# EAGLE design Eagle_Dued_autorouted (EAGLE 6.4)
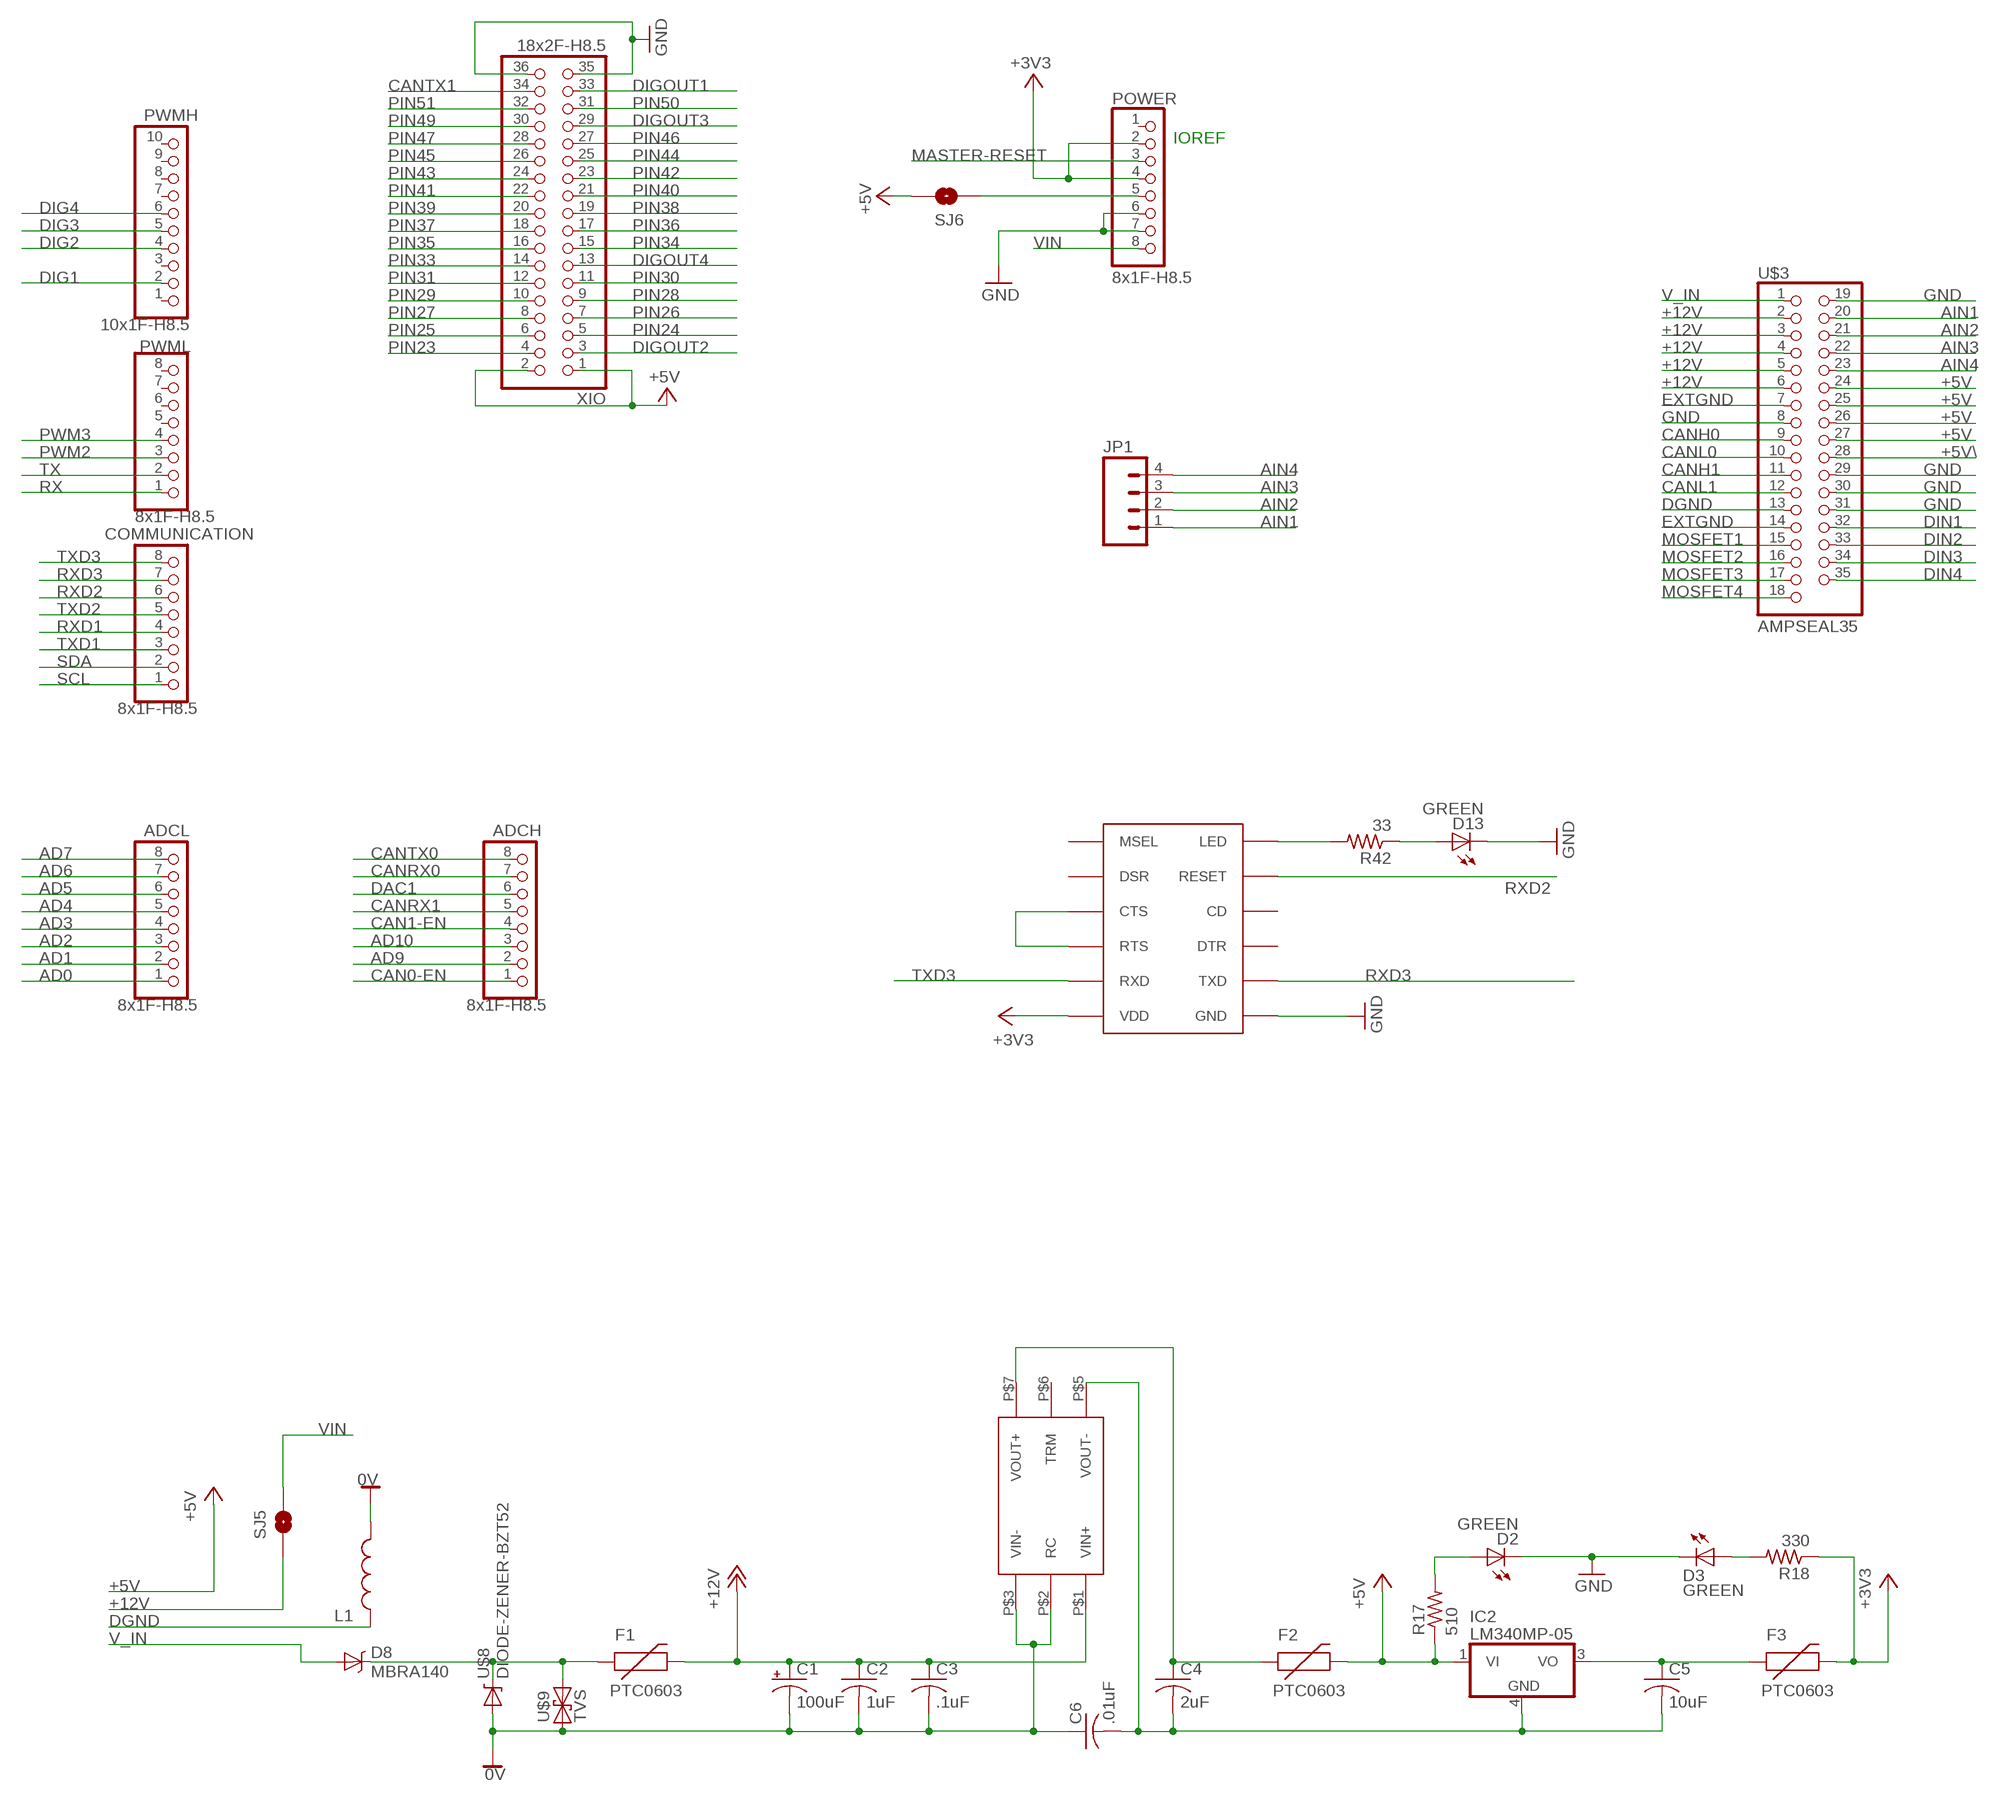
[diagram p0: schematic, sheet 1, part 1 of 2]
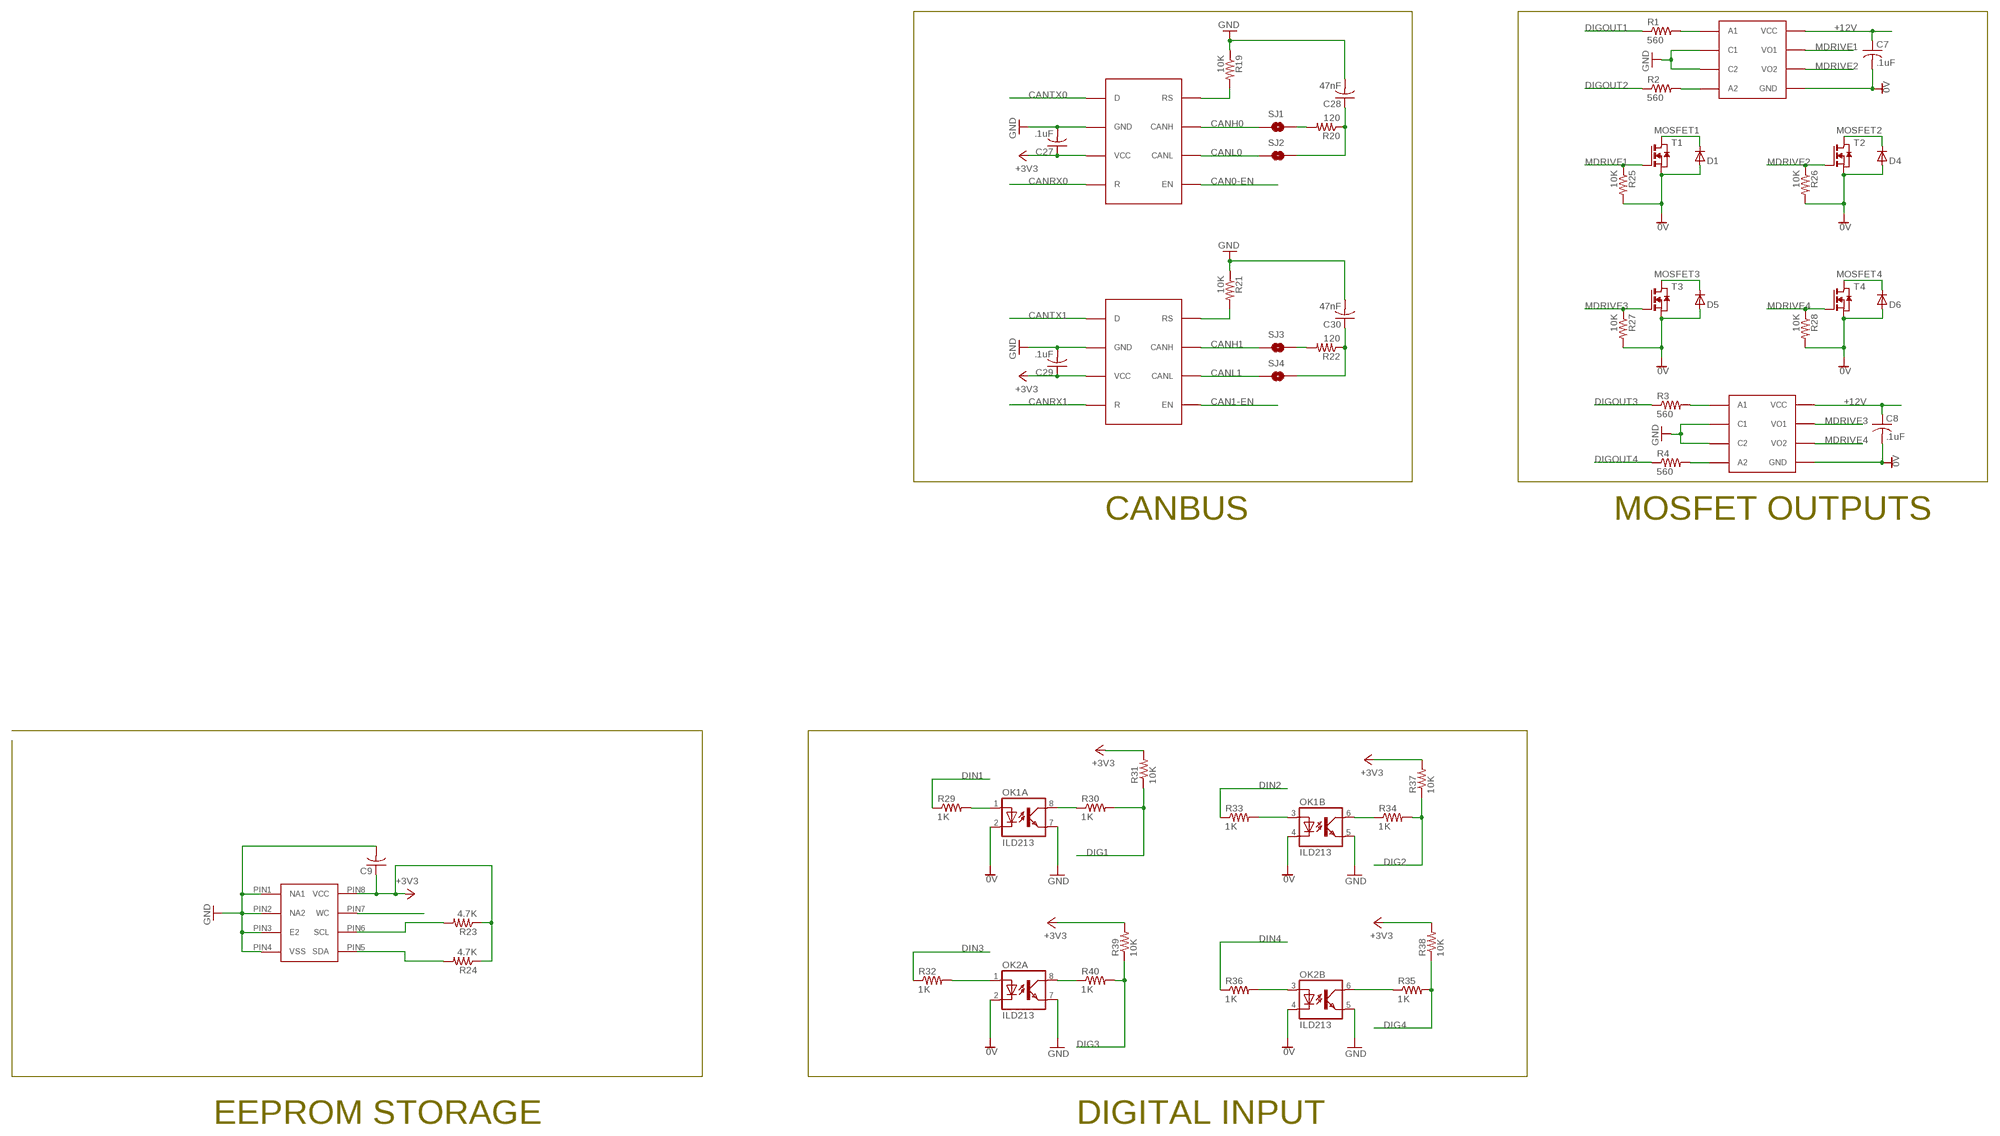
[diagram p1: schematic, sheet 1, part 2 of 2]

## Parts
ADCH  8x1F-H8.5  PINHD-1X8  [1X08]
ADCL  8x1F-H8.5  PINHD-1X8  [1X08]
C1  100uF  CPOL-USE2.5-6  [E2,5-6]
C2  1uF  C-USC1206  [C1206]
C3  .1uF  C-USC1206  [C1206]
C4  2uF  C-USC0805  [C0805]
C5  10uF  C-USC1206  [C1206]
C6  .01uF  C-USC1206  [C1206]
C7  .1uF  C-USC1206  [C1206]
C8  .1uF  C-USC1206  [C1206]
C9  C-USC0603  [C0603]
C27  .1uF  C-USC0603  [C0603]
C28  47nF  C-USC0603  [C0603]
C29  .1uF  C-USC0603  [C0603]
C30  47nF  C-USC0603  [C0603]
COMMUNICATION  8x1F-H8.5  PINHD-1X8  [1X08]
D1  MBR0520LT  [SOD123]
D2  GREEN  LED-GREEN0603  [LED-0603]
D3  GREEN  LED-GREEN0603  [LED-0603]
D4  MBR0520LT  [SOD123]
D5  MBR0520LT  [SOD123]
D6  MBR0520LT  [SOD123]
D8  MBRA140  [SMA-DIODE]
D13  GREEN  LED-GREEN0603  [LED-0603]
F1  PTC0603  [0603]
F2  PTC0603  [0603]
F3  PTC0603  [0603]
IC2  LM340MP-05  [SOT223]
JP1  M04POLAR  [MOLEX-1X4]
L1  INDUCTOR1206H*  [INDUCTOR-1206]
OK1  ILD213  [SOIC08]
OK2  ILD213  [SOIC08]
POWER  8x1F-H8.5  PINHD-1X8  [1X08]
PWMH  10x1F-H8.5  PINHD-1X10  [1X10]
PWML  8x1F-H8.5  PINHD-1X8  [1X08]
R1  560  R-US_R0603  [R0603]
R2  560  R-US_R0603  [R0603]
R3  560  R-US_R0603  [R0603]
R4  560  R-US_R0603  [R0603]
R17  510  R-US_R0603  [R0603]
R18  330  R-US_R0603  [R0603]
R19  10K  R-US_R0603  [R0603]
R20  120  R-US_R0603  [R0603]
R21  10K  R-US_R0603  [R0603]
R22  120  R-US_R0603  [R0603]
R23  4.7K  R-US_R0603  [R0603]
R24  4.7K  R-US_R0603  [R0603]
R25  10K  R-US_R0603  [R0603]
R26  10K  R-US_R0603  [R0603]
R27  10K  R-US_R0603  [R0603]
R28  10K  R-US_R0603  [R0603]
R29  1K  R-US_R0603  [R0603]
R30  1K  R-US_R0603  [R0603]
R31  10K  R-US_R0603  [R0603]
R32  1K  R-US_R0603  [R0603]
R33  1K  R-US_R0603  [R0603]
R34  1K  R-US_R0603  [R0603]
R35  1K  R-US_R0603  [R0603]
R36  1K  R-US_R0603  [R0603]
R37  10K  R-US_R0603  [R0603]
R38  10K  R-US_R0603  [R0603]
R39  10K  R-US_R0603  [R0603]
R40  1K  R-US_R0603  [R0603]
R42  33  R-US_R0603  [R0603]
SJ1  SOLDERJUMPERNO  [SJ_2S-NO]
SJ2  SOLDERJUMPERNO  [SJ_2S-NO]
SJ3  SOLDERJUMPERNO  [SJ_2S-NO]
SJ4  SOLDERJUMPERNO  [SJ_2S-NO]
SJ5  SOLDERJUMPERNO  [SJ_2S-NO]
SJ6  SOLDERJUMPERNO  [SJ_2S-NO]
T1  NMOSSOT223  [SOT223]
T2  NMOSSOT223  [SOT223]
T3  NMOSSOT223  [SOT223]
T4  NMOSSOT223  [SOT223]
U$1  CC3-E  [CC3-E]
U$2  SN65HVD234  [SOIC8]
U$3  AMPSEAL35  [AMPSEAL35]
U$4  MINIWIFI  [MINIWIFI]
U$5  M24M02-DRMN6TP  [SOIC8]
U$6  SN65HVD234  [SOIC8]
U$7  SFH6731  [DIP8]
U$8  DIODE-ZENER-BZT52  [SOD-323]
U$9  TVS  [SMA-DIODE]
U$10  SFH6731  [DIP8]
XIO  18x2F-H8.5  PINHD-2X18  [2X18]

## Nets
0V: C7.2 C8.2 OK1.2(A:C) OK1.4(B:C) OK2.2(A:C) OK2.4(B:C) U$7.5(GND) U$10.5(GND)
+3V3: C9.1 C27.1 C29.1 F3.2 POWER.2 POWER.4 R18.1 R23.1 R24.1 R31.2 R37.2 R38.2 R39.2 U$2.PIN3(VCC) U$4.P$1(VDD) U$5.PIN8(VCC) U$6.PIN3(VCC)
+5V: F2.2 IC2.1(VI) R17.1 SJ6.2 U$3.24 U$3.25 U$3.26 U$3.27 XIO.1 XIO.2
+5V\: U$3.28
+12V: C1.+ C2.1 C3.1 C7.1 C8.1 F1.2 SJ5.1 U$1.P$1(VIN+) U$3.2 U$3.3 U$3.4 U$3.5 U$3.6 U$7.8(VCC) U$10.8(VCC)
AD0: ADCL.1
AD1: ADCL.2
AD2: ADCL.3
AD3: ADCL.4
AD4: ADCL.5
AD5: ADCL.6
AD6: ADCL.7
AD7: ADCL.8
AD9: ADCH.2
AD10: ADCH.3
AIN1: JP1.1 U$3.20
AIN2: JP1.2 U$3.21
AIN3: JP1.3 U$3.22
AIN4: JP1.4 U$3.23
CAN0-EN: ADCH.1 U$6.PIN5(EN)
CAN1-EN: ADCH.4 U$2.PIN5(EN)
CANH0: SJ1.1 U$3.9 U$6.PIN7(CANH)
CANH1: SJ3.1 U$2.PIN7(CANH) U$3.11
CANL0: SJ2.1 U$3.10 U$6.PIN6(CANL)
CANL1: SJ4.1 U$2.PIN6(CANL) U$3.12
CANRX0: ADCH.7 U$6.PIN4(R)
CANRX1: ADCH.5 U$2.PIN4(R)
CANTX0: ADCH.8 U$6.PIN1(D)
CANTX1: U$2.PIN1(D) XIO.34
DAC1: ADCH.6
DGND: L1.P$1 U$3.13
DIG1: PWMH.2 R30.2 R31.1
DIG2: PWMH.4 R34.2 R37.1
DIG3: PWMH.5 R39.1 R40.2
DIG4: PWMH.6 R35.2 R38.1
DIGOUT1: R1.1 XIO.33
DIGOUT2: R2.1 XIO.3
DIGOUT3: R3.1 XIO.29
DIGOUT4: R4.1 XIO.13
DIN1: R29.1 U$3.32
DIN2: R33.1 U$3.33
DIN3: R32.1 U$3.34
DIN4: R36.1 U$3.35
EXTGND: C1.- C2.2 C3.2 C6.1 D1.A D4.A D5.A D6.A L1.P$2 R25.2 R26.2 R27.2 R28.2 T1.3(S) T2.3(S) T3.3(S) T4.3(S) U$1.P$2(RC) U$1.P$3(VIN-) U$3.7 U$3.14 U$8.2(A) U$9.A ; supply symbol labelled 0V
GND: C4.2 C5.2 C6.2 C9.2 C27.2 C28.2 C29.2 C30.2 D2.C D3.C D13.C IC2.4(GND) OK1.5(B:EMIT) OK1.7(A:EMIT) OK2.5(B:EMIT) OK2.7(A:EMIT) POWER.6 POWER.7 R19.1 R21.1 U$1.P$5(VOUT-) U$2.PIN2(GND) U$3.8 U$3.19 U$3.29 U$3.30 U$3.31 U$4.P$2(GND) U$5.PIN1(NA1) U$5.PIN2(NA2) U$5.PIN3(E2) U$5.PIN4(VSS) U$6.PIN2(GND) U$7.2(C1) U$7.3(C2) U$10.2(C1) U$10.3(C2) XIO.35 XIO.36
MASTER-RESET: POWER.3
MDRIVE1: R25.1 T1.1(G) U$10.7(VO1)
MDRIVE2: R26.1 T2.1(G) U$10.6(VO2)
MDRIVE3: R27.1 T3.1(G) U$7.7(VO1)
MDRIVE4: R28.1 T4.1(G) U$7.6(VO2)
MOSFET1: D1.C T1.2(D) T1.4(D) U$3.15
MOSFET2: D4.C T2.2(D) T2.4(D) U$3.16
MOSFET3: D5.C T3.2(D) T3.4(D) U$3.17
MOSFET4: D6.C T4.2(D) T4.4(D) U$3.18
N$1: POWER.5 SJ6.1
N$2: U$4.P$5(RTS) U$4.P$7(CTS)
N$3: D8.C F1.1 U$8.1(C) U$9.C
N$4: R42.2 U$4.P$12(LED)
N$5: R3.2 U$7.1(A1)
N$6: C4.1 F2.1 U$1.P$7(VOUT+)
N$7: R1.2 U$10.1(A1)
N$8: C5.1 F3.1 IC2.3(VO)
N$9: D13.A R42.1
N$10: R2.2 U$10.4(A2)
N$11: R4.2 U$7.4(A2)
N$23: D2.A R17.2
N$24: R19.2 U$6.PIN8(RS)
N$25: D3.A R18.2
N$26: C28.1 R20.1 SJ2.2
N$27: R20.2 SJ1.2
N$28: R21.2 U$2.PIN8(RS)
N$29: C30.1 R22.1 SJ4.2
N$30: R22.2 SJ3.2
N$31: OK1.1(A:A) R29.2
N$32: OK1.3(B:A) R33.2
N$33: OK1.8(A:COL) R30.1
N$34: OK1.6(B:COL) R34.1
N$36: OK2.6(B:COL) R35.1
N$38: OK2.8(A:COL) R40.1
N$40: OK2.1(A:A) R32.2
N$43: OK2.3(B:A) R36.2
PIN23: XIO.4
PIN24: XIO.5
PIN25: XIO.6
PIN26: XIO.7
PIN27: XIO.8
PIN28: XIO.9
PIN29: XIO.10
PIN30: XIO.11
PIN31: XIO.12
PIN33: XIO.14
PIN34: XIO.15
PIN35: XIO.16
PIN36: XIO.17
PIN37: XIO.18
PIN38: XIO.19
PIN39: XIO.20
PIN40: XIO.21
PIN41: XIO.22
PIN42: XIO.23
PIN43: XIO.24
PIN44: XIO.25
PIN45: XIO.26
PIN46: XIO.27
PIN47: XIO.28
PIN49: XIO.30
PIN50: XIO.31
PIN51: XIO.32
PWM2: PWML.3
PWM3: PWML.4
RX: PWML.1
RXD1: COMMUNICATION.4 U$5.PIN7(WC)
RXD2: COMMUNICATION.6 U$4.P$10(RESET)
RXD3: COMMUNICATION.7 U$4.P$4(TXD)
SCL: COMMUNICATION.1 R23.2 U$5.PIN6(SCL)
SDA: COMMUNICATION.2 R24.2 U$5.PIN5(SDA)
TX: PWML.2
TXD1: COMMUNICATION.3
TXD2: COMMUNICATION.5
TXD3: COMMUNICATION.8 U$4.P$3(RXD)
V_IN: D8.A U$3.1
VIN: POWER.8 SJ5.2
Unconnected: POWER.1 PWMH.1 PWMH.3 PWMH.7 PWMH.8 PWMH.9 PWMH.10 PWML.5 PWML.6 PWML.7 PWML.8 U$1.P$6(TRM) U$4.P$6(DTR) U$4.P$8(CD) U$4.P$9(DSR) U$4.P$11(MSEL)

## Notes on the sheet
- IOREF
- CANBUS | MOSFET OUTPUTS
- EEPROM STORAGE | DIGITAL INPUT

## Library data of the parts
ADCH ADCL COMMUNICATION POWER PWML = SmartPrj:PINHD-1X8: PIN HEADER
C1 = rcl:CPOL-US: POLARIZED CAPACITOR, American symbol
C2-C9 C27-C30 = rcl:C-US: CAPACITOR, American symbol
D1 D4-D6 = diode:MBR0520LT: SCHOTTKY BARRIER RECTIFIER Source: http://onsemi.com .. MBR0520LT1-D.pdf
D2 D3 D13 = SparkFun-LED:LED-GREEN: Various green LEDs 0603- DIO-00821 LARGE- DIO-00862 LILYPAD- DIO-09910; PROD_ID: DIO-00821
D8 = SparkFun-DiscreteSemi:MBRA140: 40V, 1A Schottky rectifier SMA/DO-214AC package DIO-08053; PROD_ID: DIO-08053
F1-F3 = SparkFun-PowerIC:PTC: Resettable Fuse PTC Resettable Fuse. Spark Fun Electronics SKU : COM-08357
IC2 = linear:LM340?-*: Positive VOLTAGE REGULATOR Source: http://cache.national.com/ds/LM/LM340.pdf
JP1 = SparkFun-Connectors:M04: Header 4 Standard 4-pin 0.1" header. Use with straight break away headers (SKU : PRT-00116), right angle break away headers (PRT-00553), swiss pins (PRT-00743), machine pins (PRT-00117), and female headers (PRT-00115). Molex polarized connector foot print use with SKU : PRT-08231 with associated crimp pins and housings. 1MM SMD Version SKU: PRT-10208
L1 = SparkFun-Passives:INDUCTOR: Inductors Basic Inductor/Choke - 0603 and 1206. Footprints are not proven and vary greatly between part numbers.
OK1 OK2 = optocoupler:ILD2*: Siemens ILD205/206/207/211/213/217 DUAL PHOTOTRANSISTOR SMALL OUTLINE SURFACE MOUNT OPTOCOUPLER Source: 153385-da-01-en-Optocoupler_ILD205-T.pdf; MF: VISHAY/TELEFUNKEN; MPN: ILD213T; OC_FARNELL: 1045451; OC_NEWARK: 20H8680
PWMH = SmartPrj:PINHD-1X10: PIN HEADER
R1-R4 R17-R40 R42 = rcl:R-US_: RESISTOR, American symbol
SJ1-SJ6 = SparkFun-Passives:SOLDERJUMPER: Solder Jumper Standard SMD solder jumper. Used to automate production. Two varients : Normally Open and Normally Closed are the same, but have different paste layers. NC will have a large amount of paste and should jumper during reflow.
T1-T4 = zetex:NMOSSOT223: MOS FET; OC_FARNELL: unknown; OC_NEWARK: unknown
U$1 = dc-dc-converter:CC3-E
U$2 U$6 = ck_custom:SN65HVD234
U$3 = Ampseal:AMPSEAL35: Ampseal 35 pin PCB mount
U$4 = ck_custom:MINIWIFI
U$5 = ck_custom:M24M02-DRMN6TP
U$7 U$10 = ck_custom:SFH6731
U$8 = SparkFun-DiscreteSemi:DIODE-ZENER: Zener Diode Production Part - 8199 3.4V Zener Voltage
U$9 = SparkFun-DiscreteSemi:TVS: Transient voltage suppressor- prevents ESD on inputs. Ignore package description- MBRA140 is NOT this type of part!!!
XIO = SmartPrj:PINHD-2X18: PIN HEADER

## Net classes
0 default: width 0.203 mm, drill 0.305 mm, clearance 0.203 mm
1 USB: drill 0.406 mm, clearance 0.203 mm to class 0, clearance 0.406 mm
2 gnd: width 0.305 mm, drill 0.406 mm, clearance 0.203 mm to class 0, clearance 0.203 mm
3 usbvcc: width 0.61 mm, drill 0.508 mm, clearance 0.203 mm to class 0, clearance 0.254 mm

## Board
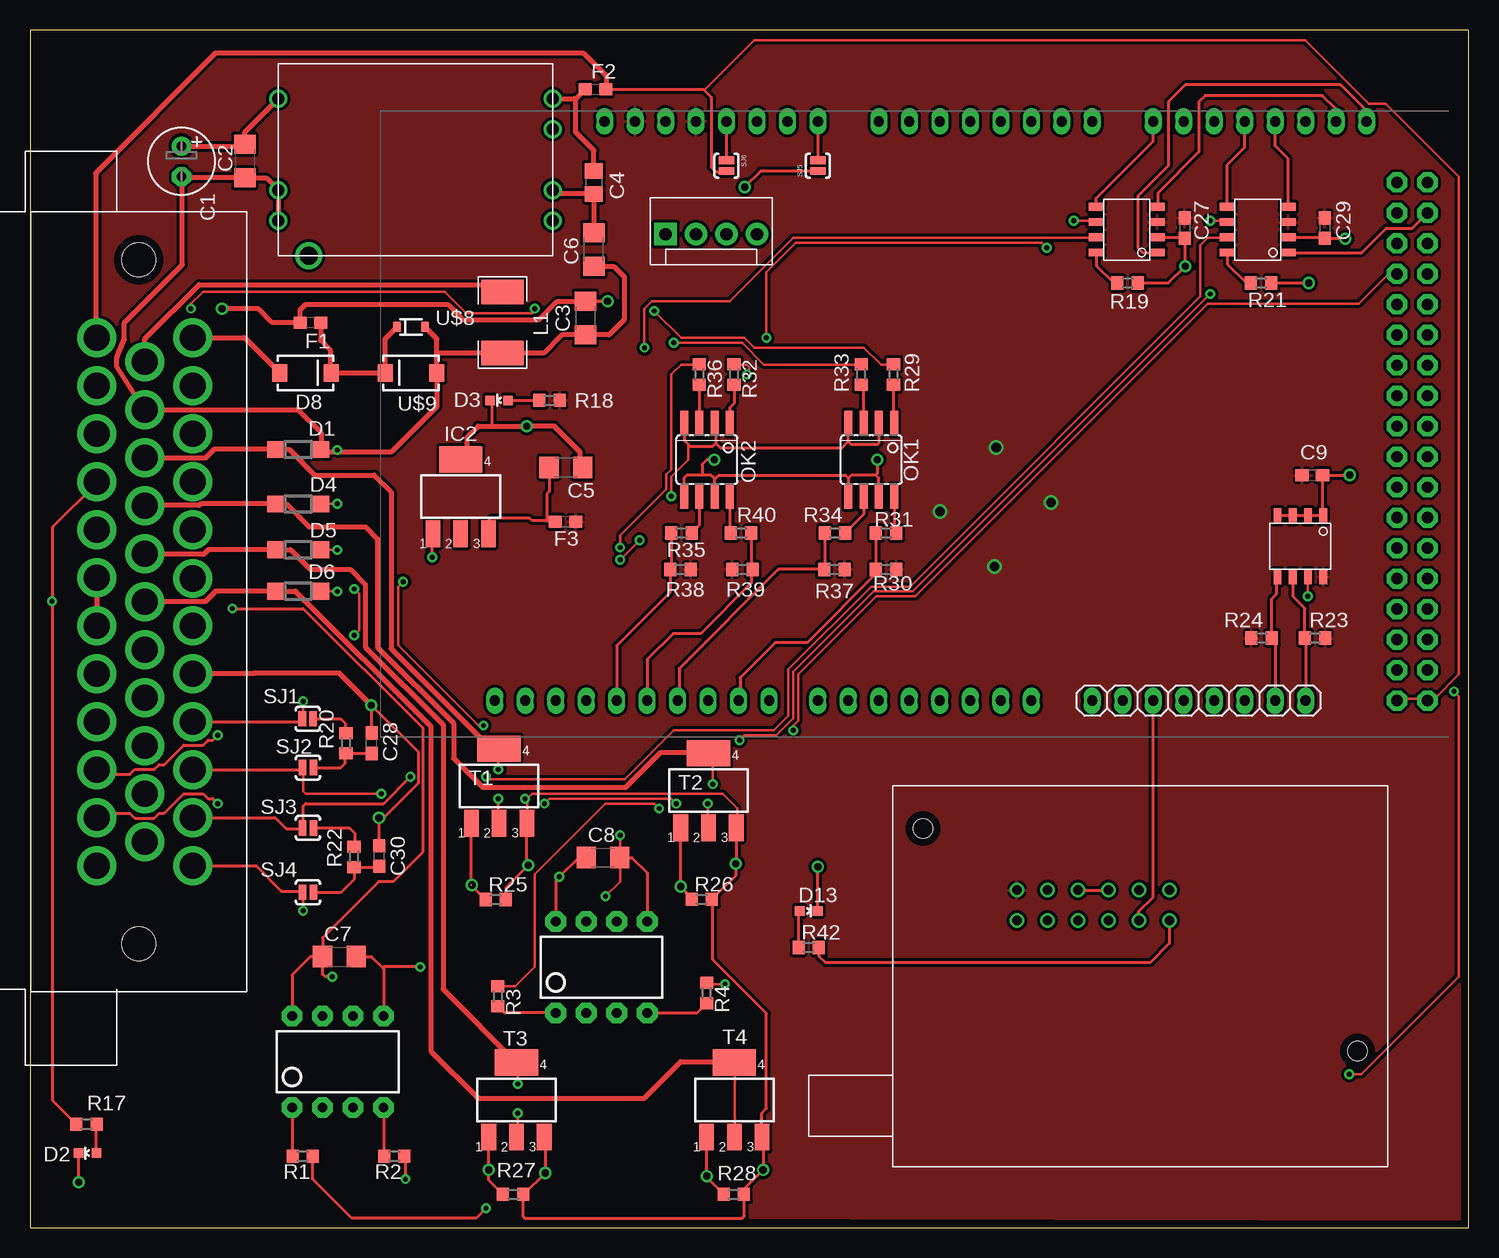
[diagram p2: board, top side]
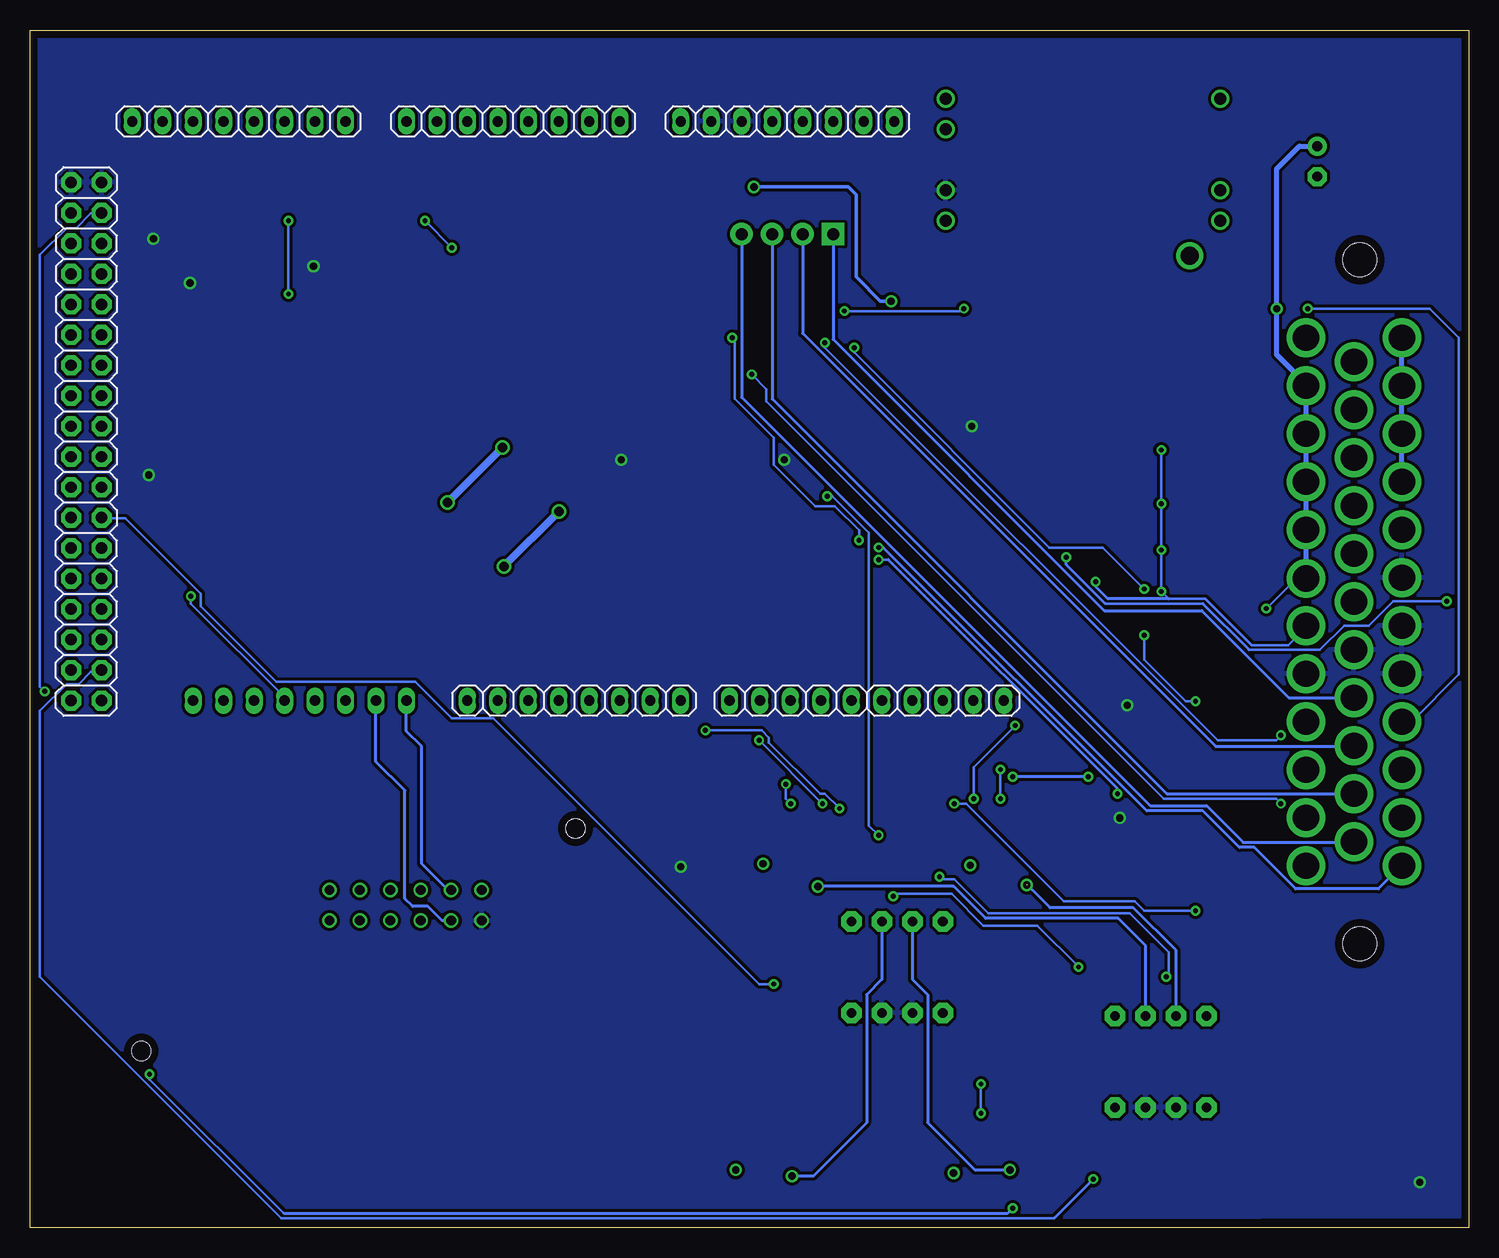
[diagram p3: board, bottom side, seen from below]

Size 119.89 x 99.82 mm. Coordinates in mm from the lower left corner, seen from the top.
Outline: 0,0 119.89,0 119.89,99.82 0,99.82 0,0
Copper layers (1*16): Top 0.035mm / dielectric 0.2mm / Bottom 0.035mm
Design rules "default *": minimum track width 10mil, minimum drill 16mil, track to track 10mil, track to pad 8mil, pad to pad 6mil, via to via 8mil, smd to smd 6mil, copper to edge 25mil, drill to drill 12mil, minimum pad ring 8mil, minimum via ring 8mil, stop-mask expansion 2mil, vias tented up to drill 25mil, thermal gap 8mil

### Footprints (pad centres in the part's own frame; a part is rotated, then mirrored left to right if it is on the bottom)
1X08 = drill 0.85 pad 1.422 long: 1 -8.89,0; 2 -6.35,0; 3 -3.81,0; 4 -1.27,0; 5 1.27,0; 6 3.81,0; 7 6.35,0; 8 8.89,0
E2,5-6 = drill 0.813 pad 1.6: + -1.27,0 | drill 0.813 pad 1.6 octagon: - 1.27,0
C1206 = smd 1.6 x 1.8: 1 -1.4,0; 2 1.4,0
C0805 = smd 1.3 x 1.5: 1 -0.95,0; 2 0.95,0
C0603 = smd 1.1 x 1: 1 -0.85,0; 2 0.85,0
SOD123 = smd 1.4 x 1.4: A 1.9,0; C -1.9,0
LED-0603 = smd 0.8 x 0.8: A 0,-0.75; C 0,0.75
SMA-DIODE = smd 1.27 x 1.47: A -2.15,0; C 2.15,0
0603 = smd 1.1 x 1: 1 -0.85,0; 2 0.85,0
SOT223 = smd 1.219 x 2.235: 1 -2.311,-3.099; 2 0,-3.099; 3 2.311,-3.099 | smd 3.6 x 2.2: 4 0,3.099
MOLEX-1X4 = drill 1.016 pad 1.88 square: 1 0,0 | drill 1.016 pad 1.88: 2 2.54,0; 3 5.08,0; 4 7.62,0
INDUCTOR-1206 = smd 2.032 x 3.556: P$1 -2.54,0; P$2 2.54,0
SOIC08 = smd 0.66 x 2.032: 1 -1.905,-3.073; 2 -0.635,-3.073; 3 0.635,-3.073; 4 1.905,-3.073; 5 1.905,3.073; 6 0.635,3.073; 7 -0.635,3.073; 8 -1.905,3.073
1X10 = drill 0.85 pad 1.422 long: 1 -11.43,0; 2 -8.89,0; 3 -6.35,0; 4 -3.81,0; 5 -1.27,0; 6 1.27,0; 7 3.81,0; 8 6.35,0; 9 8.89,0; 10 11.43,0
R0603 = smd 1 x 1.1: 1 -0.85,0; 2 0.85,0
SJ_2S-NO = smd 0.635 x 1.27: 1 -0.45,0; 2 0.45,0
CC3-E = drill 1: P$1 0,13.08; P$2 0,5.46; P$3 0,2.92; P$4 22.86,2.92; P$5 22.86,5.46; P$6 22.86,10.54; P$7 22.86,13.08 | drill 1.5: P$8 2.54,0
SOIC8 = smd 0.635 x 1.27: PIN1 0.635,-0.635; PIN2 1.905,-0.635; PIN3 3.175,-0.635; PIN4 4.445,-0.635; PIN5 4.445,4.445; PIN6 3.175,4.445; PIN7 1.905,4.445; PIN8 0.635,4.445
AMPSEAL35 = drill 2.2: 1 -20,0; 2 -16,0; 3 -12,0; 4 -8,0; 5 -4,0; 6 0.05,0; 7 4,0; 8 8,0; 9 12,0; 10 16,0; 11 20,0; 12 24,0; 13 -18,-4; 14 -14,-4; 15 -10,-4; 16 -6,-4; 17 -2,-4; 18 2,-4; 19 6,-4; 20 10,-4; 21 14,-4; 22 18,-4; 23 22,-4; 24 -20,-8; 25 -16,-8; 26 -12,-8; 27 -8,-8; 28 -4,-8; 29 0,-8; 30 4,-8; 31 8,-8; 32 12,-8; 33 16,-8; 34 20,-8; 35 24,-8 | hole 2.8: -26.5,-4.5; 30.5,-4.5
MINIWIFI = drill 0.8: P$1 30.912,8.687; P$2 30.912,11.227; P$3 28.372,8.687; P$4 28.372,11.227; P$5 25.832,8.687; P$6 25.832,11.227; P$7 23.292,8.687; P$8 23.292,11.227; P$9 20.752,8.687; P$10 20.752,11.227; P$11 18.212,8.687; P$12 18.212,11.227 | hole 1.6: 38.735,3.556; 2.54,22.098
DIP8 = drill 0.813 pad 1.727 octagon: 1 1.27,0; 2 3.81,0; 3 6.35,0; 4 8.89,0; 5 8.89,7.62; 6 6.35,7.62; 7 3.81,7.62; 8 1.27,7.62
SOD-323 = smd 0.63 x 0.83: 1 -1.15,0; 2 1.15,0
2X18 = drill 0.95 pad 1.676 octagon: 1 -21.59,-1.27; 2 -21.59,1.27; 3 -19.05,-1.27; 4 -19.05,1.27; 5 -16.51,-1.27; 6 -16.51,1.27; 7 -13.97,-1.27; 8 -13.97,1.27; 9 -11.43,-1.27; 10 -11.43,1.27; 11 -8.89,-1.27; 12 -8.89,1.27; 13 -6.35,-1.27; 14 -6.35,1.27; 15 -3.81,-1.27; 16 -3.81,1.27; 17 -1.27,-1.27; 18 -1.27,1.27; 19 1.27,-1.27; 20 1.27,1.27; 21 3.81,-1.27; 22 3.81,1.27; 23 6.35,-1.27; 24 6.35,1.27; 25 8.89,-1.27; 26 8.89,1.27; 27 11.43,-1.27; 28 11.43,1.27; 29 13.97,-1.27; 30 13.97,1.27; 31 16.51,-1.27; 32 16.51,1.27; 33 19.05,-1.27; 34 19.05,1.27; 35 21.59,-1.27; 36 21.59,1.27

### Placement (x,y rotation side)
ADCH  102.49,92.2 180 bottom
ADCL  79.63,92.2 180 bottom
C1  12.62,88.87 270 top
C2  17.91,88.9 270 top
C3  46.28,75.82 270 top
C4  46.99,87.12 270 top
C5  44.65,63.37 0 top
C6  46.99,81.53 90 top
C7  25.78,22.61 0 top
C8  47.75,30.86 0 top
C9  106.86,62.74 0 top
C27  96.22,83.31 270 top
C28  28.47,40.39 90 top
C29  107.9,83.31 270 top
C30  29.11,30.99 90 top
COMMUNICATION  97.41,43.94 180 top
D1  22.35,64.87 0 top
D2  4.78,6.22 90 top
D3  39.09,68.96 90 top
D4  22.35,60.33 0 top
D5  22.35,56.52 0 top
D6  22.35,53.06 0 top
D8  22.96,71.25 0 top
D13  64.9,26.42 270 top
F1  23.37,75.44 180 top
F2  47.12,94.87 0 top
F3  44.63,58.85 0 top
IC2  35.89,60.93 0 top
JP1  52.96,82.8 0 top
L1  39.37,75.44 270 top
OK1  70.1,64.01 180 top
OK2  56.41,64.01 180 top
POWER  56.77,92.2 180 bottom
PWMH  50.16,43.94 0 bottom
PWML  74.55,43.94 0 bottom
R1  22.73,5.97 180 top
R2  30.35,5.97 180 top
R3  38.99,19.3 270 top
R4  56.39,19.56 270 top
R17  4.72,8.64 0 top
R18  43.31,68.96 180 top
R19  91.47,78.74 180 top
R20  26.34,40.39 90 top
R21  102.59,78.74 180 top
R22  27,30.91 90 top
R23  107.09,49.15 180 top
R24  102.64,49.15 0 top
R25  38.81,27.36 0 top
R26  55.98,27.38 0 top
R27  40.26,2.79 0 top
R28  58.65,2.79 0 top
R29  71.96,71.12 270 top
R30  71.35,57.91 180 top
R31  71.35,54.86 0 top
R32  58.67,71.12 270 top
R33  69.27,71.12 270 top
R34  67.08,57.91 180 top
R35  54.28,57.91 180 top
R36  55.78,71.12 270 top
R37  67.03,54.86 0 top
R38  54.2,54.86 0 top
R39  59.36,54.86 180 top
R40  59.26,57.91 0 top
R42  64.9,23.37 0 top
SJ1  23.14,42.42 0 top
SJ2  23.16,38.35 0 top
SJ3  23.16,33.32 0 top
SJ4  23.16,27.97 0 top
SJ5  65.66,88.52 90 top
SJ6  58.04,88.52 270 top
T1  39.09,36.83 0 top
T2  56.54,36.45 0 top
T3  40.54,10.67 0 top
T4  58.7,10.67 0 top
U$1  20.7,81.03 0 top
U$2  104.22,80.64 90 top
U$3  13.56,54.18 270 top
U$4  113.16,36.83 180 top
U$5  108.41,58.7 180 top
U$6  93.29,80.64 90 top
U$7  42.55,17.91 0 top
U$8  31.75,75.08 0 top
U$9  31.75,71.25 180 top
U$10  20.57,10.03 0 top
XIO  115.19,65.53 90 bottom

### Tracks (layer width: path | path; a pad name or v marks a point on that pad's centre or on a via)
0V  (via drill 0.41)
  Top 0.203: v47.95,27.64 49.17,28.85 49.17,30.68 C8.2 49.17,30.89 v49.17,32.72 | 29.46,21.74 29.39,21.67 | v53.44,60.96 53.44,62.59 54.86,64.01 54.86,65.23 54.89,65.25
  Top 0.254: OK1.2 70.74,65.41 70.61,65.28 68.45,65.28 68.2,65.53 | 68.2,65.53 OK1.4 | OK2.4 54.51,65.63 54.89,65.25 54.99,65.15 56.9,65.15 57.15,65.41 | OK2.2 57.15,66.98 57.15,65.41 | 57.15,65.41 57.53,65.02 67.69,65.02 68.2,65.53 | C7.2 28.45,22.61 29.39,21.67 29.46,21.59 U$10.5 | C8.2 50.16,30.86 51.44,29.59 U$7.5 | v32.51,21.74 29.46,21.74
  Bottom 0.203: v32.51,21.74 35.97,25.2 40.44,25.2 43.08,27.84 47.75,27.84 v47.95,27.64 | v53.44,60.96 53.03,60.96 49.99,57.91 49.99,33.53 v49.17,32.72
+3V3  (via drill 0.8)
  Bottom 0.61: v75.82,59.69 v80.39,55.12 | v80.52,65.02 v85.09,60.45
  pour Top: 0.28,99.09 0.3,0.99 119.46,0.74 119.46,99.06
+5V  (via drill 0.41)
  Top 0.203: v1.83,52.22 1.91,52.22 | U$3.27 5.69,62.18 5.59,62.1 | XIO.1 114,44.09 116.43,44.09 XIO.2 116.64,44.09 117.04,44.09 119.08,46.13 119.08,87.58 112.98,93.67 111.56,93.67 106.27,98.96 60.35,98.96 56.2,94.81 | U$3.24 5.69,74.17 5.59,74.17
  Top 0.254: 3.94,8.7 R17.1 1.91,10.61 1.91,52.22 1.91,58.42 5.59,62.1 | F2.2 56.13,94.87 56.2,94.81 56.77,94.23 56.77,88.39 57.15,88.01 57.98,88.01 SJ6.2 | v33.53,55.88 33.53,57.71 IC2.1
  Top 0.406: 5.59,74.17 5.46,74.3 5.46,87.88 15.49,97.92 46.1,97.92 48.01,96.01 48.01,94.91 F2.2
  Bottom 0.203: 22.15,52.02 30.28,52.02 | 18.29,48.16 12.39,48.16 10.36,50.19 8.33,50.19 6.3,52.22 v1.83,52.22
  Bottom 0.254: v33.53,55.88 33.53,55.27 30.28,52.02 | 18.29,48.16 22.15,52.02
  Bottom 0.406: U$3.27 U$3.26 U$3.25 U$3.24
+12V  (via drill 0.41, 0.6)
  Top 0.203: 24.38,22.55 C7.1 24.38,22.76 | v44.09,29.26 44.11,29.25
  Top 0.254: SJ5.1 60.89,88.07 v59.56,86.74 | C7.1 23.37,22.61 21.84,21.08 U$10.8 | C8.1 45.72,30.86 44.11,29.25 43.81,28.96 U$7.8 | 24.38,22.55 24.38,21.13 24.59,20.93 v25.2,20.93 | 24.38,22.76 24.38,24.18 29.06,28.85 30.28,28.85 32.72,31.29 32.72,41.66 22.76,51.61 v16.87,51.61
  Top 0.305: C3.1 v48.13,77.22
  Top 0.406: C1.+ 17.75,90.14 C2.1 17.91,91.31 U$1.P$1 | C3.1 43.94,77.22 42.42,75.69 36.07,75.69 34.8,76.96 22.99,76.96 22.52,76.49 F1.2 20.19,75.44 19.05,76.58 v16,76.58
  Bottom 0.203: v25.2,20.93 24.99,21.13 24.99,22.96 28.25,26.21 40.03,26.21 42.88,29.06 43.89,29.06 v44.09,29.26 | v16.87,51.61 14.43,54.05 13.61,54.05 U$3.6
  Bottom 0.305: v48.13,77.22 49.02,77.22 51.05,79.25 51.05,86.11 51.69,86.74 v59.56,86.74
  Bottom 0.406: U$3.6 U$3.5 U$3.4 U$3.3 U$3.2 13.56,70.33 16,72.77 v16,76.58 16,88.24 14.1,90.14 C1.+
AIN1
  Bottom 0.254: JP1.1 52.96,74.04 30.35,51.44 22.23,51.44 14.99,44.2 9.58,44.2 U$3.20
AIN2
  Bottom 0.254: JP1.2 55.5,74.55 21.08,40.13 9.61,40.13 U$3.21
AIN3
  Bottom 0.254: JP1.3 58.04,69.09 25.15,36.2 9.58,36.2 U$3.22
AIN4
  Bottom 0.254: JP1.4 60.58,69.22 26.54,35.18 21.84,35.18 18.8,32.13 9.61,32.13 U$3.23
CAN0-EN
  Top 0.254: U$6.PIN5 88.85,85.8 93.6,90.55 ADCH.1
CAN1-EN
  Top 0.254: U$2.PIN5 99.77,88.59 101.22,90.04 ADCH.4
CANH0  (via drill 0.41)
  Top 0.203: v51.21,73.36 51.21,76.61 51.82,77.22 58.32,77.22 63.6,82.5 88.8,82.5 U$6.PIN7 | v27.03,53.24 27.43,52.83 27.43,49.78 v27.03,49.38 | v22.76,43.89 22.76,42.47 SJ1.1
  Top 0.254: U$3.9 22.45,42.18 SJ1.1
  Bottom 0.203: v51.21,73.36 51.21,72.95 34.95,56.69 30.48,56.69 v27.03,53.24 | v27.03,49.38 27.03,47.35 23.57,43.89 v22.76,43.89
CANH1  (via drill 0.41)
  Top 0.203: v38,37.59 38.2,37.39 49.58,37.39 53.65,41.45 61.98,41.45 63.2,42.67 63.2,46.53 70.1,53.44 73.36,53.44 97.54,77.62 97.54,81.89 98.15,82.5 99.77,82.5 U$2.PIN7 | 22.76,33.33 SJ3.1
  Top 0.254: U$3.11 20.43,34.18 21.34,33.27 22.66,33.27 SJ3.1 | v31.7,37.59 29.46,35.36 22.96,35.36 22.76,35.15 22.76,33.33
  Bottom 0.254: v31.7,37.59 v38,37.59
CANL0  (via drill 0.41)
  Top 0.203: v86.97,83.92 88.8,83.92 U$6.PIN6 | v84.73,81.69 84.33,82.09 63.8,82.09 61.37,79.65 v61.37,74.17 | v49.17,55.68 v50.8,57.3 | v29.26,36.17 22.96,36.17 22.76,36.37 22.76,38.2 SJ2.1
  Top 0.254: U$3.10 22.54,38.18 SJ2.1
  Bottom 0.203: v84.73,81.69 v86.97,83.92 | v61.37,74.17 61.16,73.97 61.16,69.09 57.91,65.84 57.91,63.6 54.46,60.15 52.83,60.15 50.8,58.12 v50.8,57.3 | 48.36,55.68 v49.17,55.68
  Bottom 0.254: 48.36,55.68 29.26,36.58 v29.26,36.17
CANL1  (via drill 0.41)
  Top 0.203: v98.35,83.92 99.77,83.92 U$2.PIN6 | v98.35,77.83 73.56,53.03 70.31,53.03 63.6,46.33 63.6,42.47 62.18,41.05 59.54,41.05 v59.13,40.64 | v53.85,35.36 53.44,35.76 43.28,35.76 v42.88,35.36 | v22.76,26.42 22.76,27.84 SJ4.1
  Top 0.254: U$3.12 18.84,30.18 20.95,28.07 22.61,28.07 SJ4.1
  Bottom 0.203: v98.35,77.83 v98.35,83.92 | v53.85,35.36 v59.13,40.64 | v42.88,35.36 41.86,35.36 33.73,27.23 27.84,27.23 27.03,26.42 v22.76,26.42
CANRX0
  Top 0.254: ADCH.7 108.84,93.22 107.7,94.36 97.92,94.36 97.41,93.85 97.41,89.66 93.98,86.23 93.98,85.14 U$6.PIN4
CANRX1
  Top 0.254: U$2.PIN4 104.85,89.08 103.76,90.17 ADCH.5
CANTX0
  Top 0.254: ADCH.8 111.38,93.09 109.22,95.25 96.27,95.25 94.87,93.85 94.87,88.52 92.33,85.98 92.33,81.66 92.71,81.28 U$6.PIN1
CANTX1
  Top 0.254: U$2.PIN1 111,81.28 113.03,83.31 115.19,83.31 XIO.34
DGND
  Top 0.406: U$3.13 9.56,74.08 14.1,78.61 38.73,78.61 L1.P$1
DIG1
  Top 0.254: R30.2 R31.1 70.5,54.5 64.77,48.77 62.1,48.77 59.18,45.85 59.18,44.07 PWMH.2
DIG2
  Top 0.254: R34.2 66.23,54.91 R37.1 62.36,54.86 54.1,46.61 54.1,44.07 PWMH.4
DIG3
  Top 0.254: R40.2 60.11,54.97 | 60.11,54.97 R39.1 | 60.11,54.97 60.11,53.76 55.88,49.53 53.59,49.53 51.44,47.37 PWMH.5
DIG4
  Top 0.254: R35.2 53.43,54.94 R38.1 53.35,52.97 48.9,48.51 PWMH.6
DIGOUT1  (via drill 0.41)
  Top 0.203: v109.93,12.8 110.95,12.8 119.08,20.93 119.08,44.3 v118.67,44.7 | 23.57,5.89 R1.1
  Top 0.254: 23.57,5.89 23.57,4.06 26.82,0.81 37.19,0.81 v38,1.63
  Bottom 0.203: 98.75,1.22 109.93,12.39 v109.93,12.8 | v118.67,44.7 119.08,45.11 119.08,81.08 116.84,83.31 116.03,83.31 114.81,84.53 114,84.53 XIO.33
  Bottom 0.254: v38,1.63 38.41,1.22 98.75,1.22
DIGOUT2  (via drill 0.41)
  Top 0.203: 31.29,5.89 R2.1
  Top 0.254: v31.29,4.06 31.29,5.89
  Bottom 0.203: 34.54,0.81 98.96,0.81 119.08,20.93 119.08,43.08 116.84,45.31 115.82,45.31 114.81,46.33 114,46.33 XIO.3
  Bottom 0.254: 34.54,0.81 v31.29,4.06
DIGOUT3  (via drill 0.41)
  Top 0.203: v52.43,34.95 52.02,35.36 47.95,35.36 42.06,29.46 42.06,21.74 40.44,20.12 39.01,20.12 R3.1 | v63.6,41.45 63.6,41.86 64.01,42.27 64.01,46.13 70.51,52.63 73.76,52.63 98.15,77.01 110.74,77.01 113.18,79.45 113.79,79.45 XIO.29
  Bottom 0.203: v52.43,34.95 53.65,36.17 54.05,36.17 58.32,40.44 58.32,40.84 58.93,41.45 v63.6,41.45
DIGOUT4  (via drill 0.41)
  Top 0.203: v57.91,20.32 56.49,20.32 R4.1
  Bottom 0.203: v57.91,20.32 59.13,20.32 81.28,42.47 84.73,42.47 87.78,45.52 99.36,45.52 105.66,51.82 105.66,52.83 111.96,59.13 113.79,59.13 XIO.13
DIN1  (via drill 0.41)
  Top 0.203: v52.02,76.4 54.25,74.17 59.54,74.17 60.35,73.36 69.49,73.36 70.92,71.93 71.93,71.93 R29.1 | v42.06,76.61 42.06,76.4 41.86,76.2 36.37,76.2 34.54,78.03 14.43,78.03 13.41,77.01 v13.41,76.61
  Bottom 0.203: v52.02,76.4 42.27,76.4 v42.06,76.61 | v13.41,76.61 3.25,76.61 0.81,74.17 0.81,46.13 4.67,42.27 5.49,42.27 U$3.32
DIN2  (via drill 0.41)
  Top 0.203: v53.65,73.76 59.33,73.76 61.16,71.93 69.09,71.93 R33.1
  Top 0.254: v15.65,41.05 15.24,40.64 14.83,40.64 14.43,40.23 12.8,40.23 11.18,38.61 10.77,38.61 10.36,38.2 8.74,38.2 8.33,37.8 5.89,37.8 5.69,38 U$3.33
  Bottom 0.203: v53.65,73.76 53.65,73.36 20.93,40.64 16.05,40.64 v15.65,41.05
DIN3  (via drill 0.41)
  Top 0.203: v59.74,71.12 59.94,71.32 59.94,71.73 59.74,71.93 58.73,71.93 R32.1
  Top 0.254: v15.65,35.36 15.24,35.76 14.83,35.76 14.43,36.17 12.8,36.17 11.18,34.54 10.77,34.54 10.36,34.14 8.74,34.14 8.33,34.54 5.89,34.54 5.69,34.34 U$3.34
  Bottom 0.203: v59.74,71.12 58.52,69.9 58.52,68.89 25.4,35.76 16.05,35.76 v15.65,35.36
DIN4  (via drill 0.41)
  Top 0.203: v49.17,56.69 49.17,57.71 53.03,61.57 53.03,62.79 53.44,63.2 53.44,71.12 54.25,71.93 55.68,71.93 R36.1
  Bottom 0.203: 48.77,56.69 v49.17,56.69
  Bottom 0.254: 48.77,56.69 26.82,34.75 22.15,34.75 19.1,31.7 17.88,31.7 14.43,28.25 7.52,28.25 5.69,30.07 U$3.35
EXTGND  (via drill 0.41, 0.6)
  Top 0.203: 41.45,35.76 41.86,36.17 57.71,36.17 58.93,34.95 58.93,33.53 T2.3 | 41.45,35.76 41.45,33.73 T1.3 | 59.54,2.64 R28.2 | 56.9,27.23 R26.2 | 60.96,7.72 T4.3 | v25.6,53.03 24.38,53.03 D6.A | v25.6,56.49 24.38,56.49 D5.A | v25.6,60.35 24.38,60.35 D4.A | v25.6,64.82 25.6,64.64 | U$3.14 9.55,68.28 9.5,68.24 | C1.- 12.8,87.78 12.7,87.63 | v41.25,35.76 41.45,35.76 | v37.8,41.86 37.39,41.86 30.68,48.56 30.68,53.44 v31.09,53.85
  Top 0.254: T1.3 41.4,30.35 v41.53,30.23 39.66,28.36 R25.2 | T3.3 42.93,7.49 v42.93,4.57 41.15,2.79 R27.2 41.05,2.64 41.05,1.02 41.25,0.81 59.33,0.81 59.54,1.02 59.54,2.64 | T4.3 61.09,7.49 v61.09,4.83 59.5,3.24 R28.2 | T2.3 58.85,30.4 v58.8,30.35 58.8,29.35 R26.2 | 56.9,27.23 56.9,22.35 61.37,17.88 61.37,9.96 60.96,9.55 60.96,7.72
  Top 0.406: 33.9,73.03 U$9.A 33.9,68.44 30.1,64.64 25.6,64.64 24.48,64.64 D1.A 24.26,66.29 22.37,68.18 U$3.14 | 33.9,73.03 33.9,74.08 U$8.2 | C6.1 48.64,80.13 49.53,79.25 49.53,75.69 48.26,74.42 C3.2 | C3.2 | C1.- 12.73,87.5 C2.2 19.69,87.5 U$1.P$2 U$1.P$3 | 12.7,87.63 12.7,80.26 7.87,75.44 7.87,74.04 7.24,72.52 7.24,71.75 9.5,68.24 9.53,68.2 | C3.2 44.32,74.42 42.8,72.9 L1.P$2 34.03,72.9 33.9,73.03
  Bottom 0.203: v25.6,64.82 v25.6,60.35 v25.6,56.49 v25.6,53.03 24.99,52.43 21.95,52.43 | 18.09,48.56 15.04,48.56 13.61,49.99 U$3.7 | v41.25,35.76 41.25,38.41 v37.8,41.86 | 31.09,53.44 v31.09,53.85
  Bottom 0.254: 21.95,52.43 18.09,48.56 | 31.09,53.44 30.07,52.43 24.99,52.43
GND  (via drill 0.6)
  Top 0.203: 65.65,30.07 65.63,30.07 v65.66,30.1
  Top 0.254: D13.C 65.65,30.07 65.65,30.11 | v4.06,3.81 4.06,6.18 D2.C | C30.2 29.11,34.14 v29.08,34.16 29.46,34.16 32.38,37.08 32.38,39.62 v28.45,43.56 28.47,43.54 C28.2 | U$2.PIN2 107.81,82.55 C29.2 109.56,82.46 v109.6,82.42 | U$6.PIN2 96.13,82.55 C27.2 96.27,82.41 v96.27,80.14 94.87,78.74 R19.1 | R21.1 v106.55,78.74 | v109.98,62.74 C9.2 107.71,59.4 U$5.PIN1 U$5.PIN2 U$5.PIN3 U$5.PIN4 | OK1.7 70.74,62.48 70.48,62.74 | 70.48,62.74 68.45,62.74 68.2,62.48 | 68.2,62.48 OK1.5 | 56.01,62.74 56.77,62.74 57.05,62.46 OK2.7 57.05,62.38 57.4,62.74 67.94,62.74 68.2,62.48 | 56.01,62.74 54.74,62.74 54.48,62.48 54.48,60.96 OK2.5 | v70.61,64.01 70.61,62.87 70.48,62.74 | v57.02,64.01 56.39,64.01 56.01,63.63 56.01,62.74 | D3.C 38.48,68.96 38.48,66.8
  Top 0.406: U$1.P$5 43.88,86.17 C4.2 C6.2 | IC2.4 36.45,64.59 36.45,65.91 37.34,66.8 38.48,66.8 v41.4,66.8 43.69,66.8 45.85,64.64 45.85,63.58 C5.2 | U$3.29 U$3.30 | v28.45,43.56 25.78,46.23 18.67,46.23 18.62,46.18 U$3.8
  pour Bottom: 0.28,99.09 119.46,99.06 119.46,0.74 0.3,0.99
MDRIVE1  (via drill 0.6)  (2 unrouted)
  Top 0.254: R25.1 37.43,27.88 36.78,28.54 T1.1
  Bottom 0.254: U$10.7 24.38,23.11 27.94,26.67 34.87,26.67 35.9,27.7 36.78,28.57
  other vias: 36.83,28.57
MDRIVE2  (via drill 0.6)
  Top 0.254: R26.1 54.23,28.41 v54.23,28.45 T2.1
  Bottom 0.254: U$10.6 26.92,23.5 29.21,25.78 40.26,25.78 42.93,28.45 v54.23,28.45
MDRIVE3  (via drill 0.6)
  Top 0.254: R27.1 38.23,3.98 v38.23,4.83 T3.1
  Bottom 0.254: U$7.7 46.35,20.7 45.09,19.43 45.09,8.76 41.15,4.83 v38.23,4.83
MDRIVE4  (via drill 0.6)
  Top 0.254: R28.1 56.39,4.21 v56.39,4.32 T4.1
  Bottom 0.254: U$7.6 48.9,20.7 50.16,19.43 50.16,8.76 54.61,4.32 v56.39,4.32
MOSFET1  (via drill 0.41)
  Top 0.203: v39.01,35.76 39.01,33.73 T1.2 | v39.01,38.2 39.01,39.83 T1.4
  Top 0.406: U$3.15 9.61,64.14 14.61,64.14 15.34,64.87 D1.C 21.61,64.87 23.75,62.74 28.7,62.74 30.1,61.34 30.1,48.26 38.23,40.13 38.89,40.13 T1.4
  Bottom 0.203: v39.01,38.2 v39.01,35.76
MOSFET2  (via drill 0.41)
  Top 0.203: 56.77,39.5 56.69,39.42 T2.4 56.9,39.22 v56.9,36.98 | v56.49,35.36 56.49,33.53 T2.2
  Top 0.406: U$3.16 9.58,60.2 14.1,60.2 14.22,60.33 D4.C 21.34,60.33 23.24,58.42 27.94,58.42 28.96,57.4 28.96,48.39 35.31,42.04 35.31,39.12 37.72,36.7 49.66,36.7 52.58,39.62 56.46,39.62 T2.4 | 56.64,39.62 56.77,39.5 57.02,39.24
  Bottom 0.203: v56.9,36.98 56.9,35.76 v56.49,35.36
MOSFET3  (via drill 0.41)
  Top 0.203: v40.64,9.55 40.64,7.72 T3.2 | v40.64,11.99 40.64,13.61 T3.4
  Top 0.406: U$3.17 9.61,56.13 14.48,56.13 14.86,56.52 D5.C 21.72,56.52 23.37,54.86 26.67,54.86 27.94,53.59 27.94,48.39 34.42,41.91 34.42,19.89 T3.4 40.46,13.84
  Bottom 0.203: v40.64,11.99 v40.64,9.55
MOSFET4
  Top 0.203: T4.2 58.73,7.72 58.73,13.61 T4.4
  Top 0.406: U$3.18 9.58,52.2 14.61,52.2 15.47,53.06 D6.C 22.12,53.06 33.4,41.78 33.4,14.73 37.34,10.79 51.18,10.79 54.23,13.84 58.62,13.84 T4.4 58.65,13.72
N$1
  Top 0.254: POWER.5 SJ6.1
N$2
  Top 0.254: U$4.P$5 U$4.P$7
N$3
  Top 0.406: U$8.1 29.6,74.08 U$9.C D8.C 25.02,71.34 25.02,73.15 24.22,73.95 F1.1
N$4
  Top 0.254: U$4.P$12 94.94,23.7 93.34,22.1 66.29,22.1 65.79,22.61 65.79,23.33 R42.2
N$5
  Top 0.254: U$7.1 39.54,17.91 R3.2
N$6
  Top 0.406: U$1.P$7 45.34,94.11 | 45.34,94.11 45.5,94.11 F2.1 | C4.1 46.99,89.79 45.47,91.31 45.47,93.98 45.34,94.11
N$7
  Top 0.254: U$10.1 21.84,6.01 R1.2
N$8
  Top 0.254: 43.08,58.93 43.69,58.93 F3.1 | 43.08,58.93 43.08,61.16 43.28,61.37 43.28,63.2 C5.1 | IC2.3 38.2,58.93 38.41,59.13 41.66,59.13 41.86,58.93 43.08,58.93
N$9
  Top 0.254: R42.1 64.05,26.32 D13.A
N$10
  Top 0.254: U$10.4 29.46,6.01 R2.2
N$11
  Top 0.254: U$7.4 55.59,17.91 R4.2
N$23
  Top 0.254: D2.A 5.53,8.59 R17.2
N$24
  Top 0.254: R19.2 90.3,78.74 88.9,80.14 88.9,81.23 U$6.PIN8
N$25
  Top 0.254: D3.A R18.2
N$26
  Top 0.254: SJ2.2 25.91,38.35 26.29,38.73 26.29,39.48 R20.1 C28.1
N$27
  Top 0.254: SJ1.2 25.91,42.42 26.29,42.04 26.29,41.29 R20.2
N$28
  Top 0.254: R21.2 101.35,78.74 99.82,80.26 99.82,81.23 U$2.PIN8
N$29
  Top 0.254: SJ4.2 25.93,27.96 27.05,29.08 27.05,30.01 R22.1 29.03,30.06 C30.1
N$30
  Top 0.254: SJ3.2 26.62,33.33 27.05,32.89 27.05,31.81 R22.2
N$31
  Top 0.254: R29.2 71.96,67.13 OK1.1
N$32
  Top 0.254: OK1.3 69.47,70.07 R33.2
N$33
  Top 0.254: OK1.8 72.01,58.1 R30.1
N$34
  Top 0.254: OK1.6 69.47,59.45 R34.1
N$36
  Top 0.254: OK2.6 55.78,58.56 R35.1
N$38
  Top 0.254: OK2.8 58.32,58 R40.1
N$40
  Top 0.254: R32.2 58.67,68.71 58.29,68.33 58.29,67.11 OK2.1
N$43
  Top 0.254: R36.2 OK2.3
RXD1  (via drill 0.41)
  Top 0.203: v106.48,52.63 106.48,54.25 U$5.PIN7
  Bottom 0.203: v106.48,52.63 106.48,52.02 98.55,44.09 COMMUNICATION.4
RXD2
  Top 0.254: U$4.P$10 92.41,26.36 93.6,27.56 COMMUNICATION.6
RXD3
  Bottom 0.254: U$4.P$4 85.55,25.6 86.74,26.8 88.01,26.8 88.65,27.43 88.65,36.45 91.06,38.86 COMMUNICATION.7
SCL
  Top 0.254: COMMUNICATION.1 106.3,49.15 R23.2 106.24,51.62 105.28,52.58 105.28,54.2 U$5.PIN6
SDA
  Top 0.254: COMMUNICATION.2 103.76,49.15 R24.2 103.49,52.44 103.89,52.83 103.89,54.18 U$5.PIN5
TXD3
  Bottom 0.254: U$4.P$3 85.04,28.14 87.25,30.35 87.25,40.13 88.52,41.4 COMMUNICATION.8
V_IN
  Top 0.406: U$3.1 17.88,74.18 D8.A
VIN
  Top 0.254: POWER.8 SJ5.2